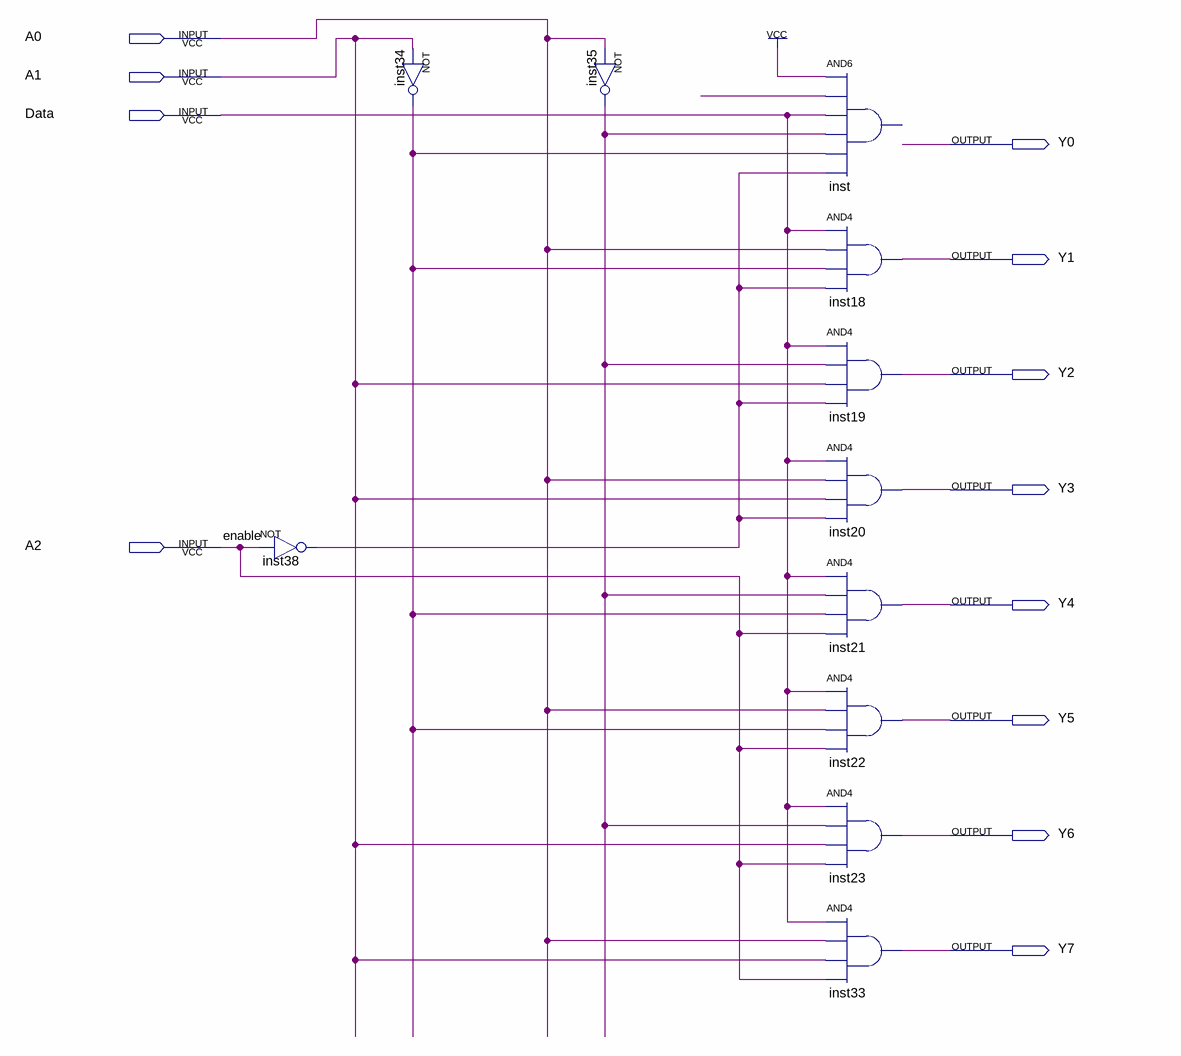
[diagram p0: schematic sheet]
// Quartus schematic lab1.bdf as structural Verilog: 11 symbols, 12 pins
module lab1 (
  input  A0,
  input  A1,
  input  Data,
  input  A2,
  output Y0,
  output Y1,
  output Y2,
  output Y3,
  output Y4,
  output Y5,
  output Y6,
  output Y7
);

  wire enable, inst34_out, inst35_out, undriven;

  not inst38 (enable, A2);
  not inst34 (inst34_out, A1);
  not inst35 (inst35_out, A0);
  // AND6 inst has open pins: IN1=1'b1, IN2=undriven, IN3=Data, IN4=inst35_out, IN5=inst34_out, IN6=enable, OUT=open
  and inst18 (Y1, Data, A0, inst34_out, enable);
  and inst19 (Y2, Data, inst35_out, A1, enable);
  and inst20 (Y3, Data, A0, A1, enable);
  and inst21 (Y4, Data, inst35_out, inst34_out, A2);
  and inst22 (Y5, Data, A0, inst34_out, A2);
  and inst23 (Y6, Data, inst35_out, A1, A2);
  and inst33 (Y7, Data, A0, A1, A2);
endmodule
